# Altium schematic sheet LEDs.SchDoc
size A4
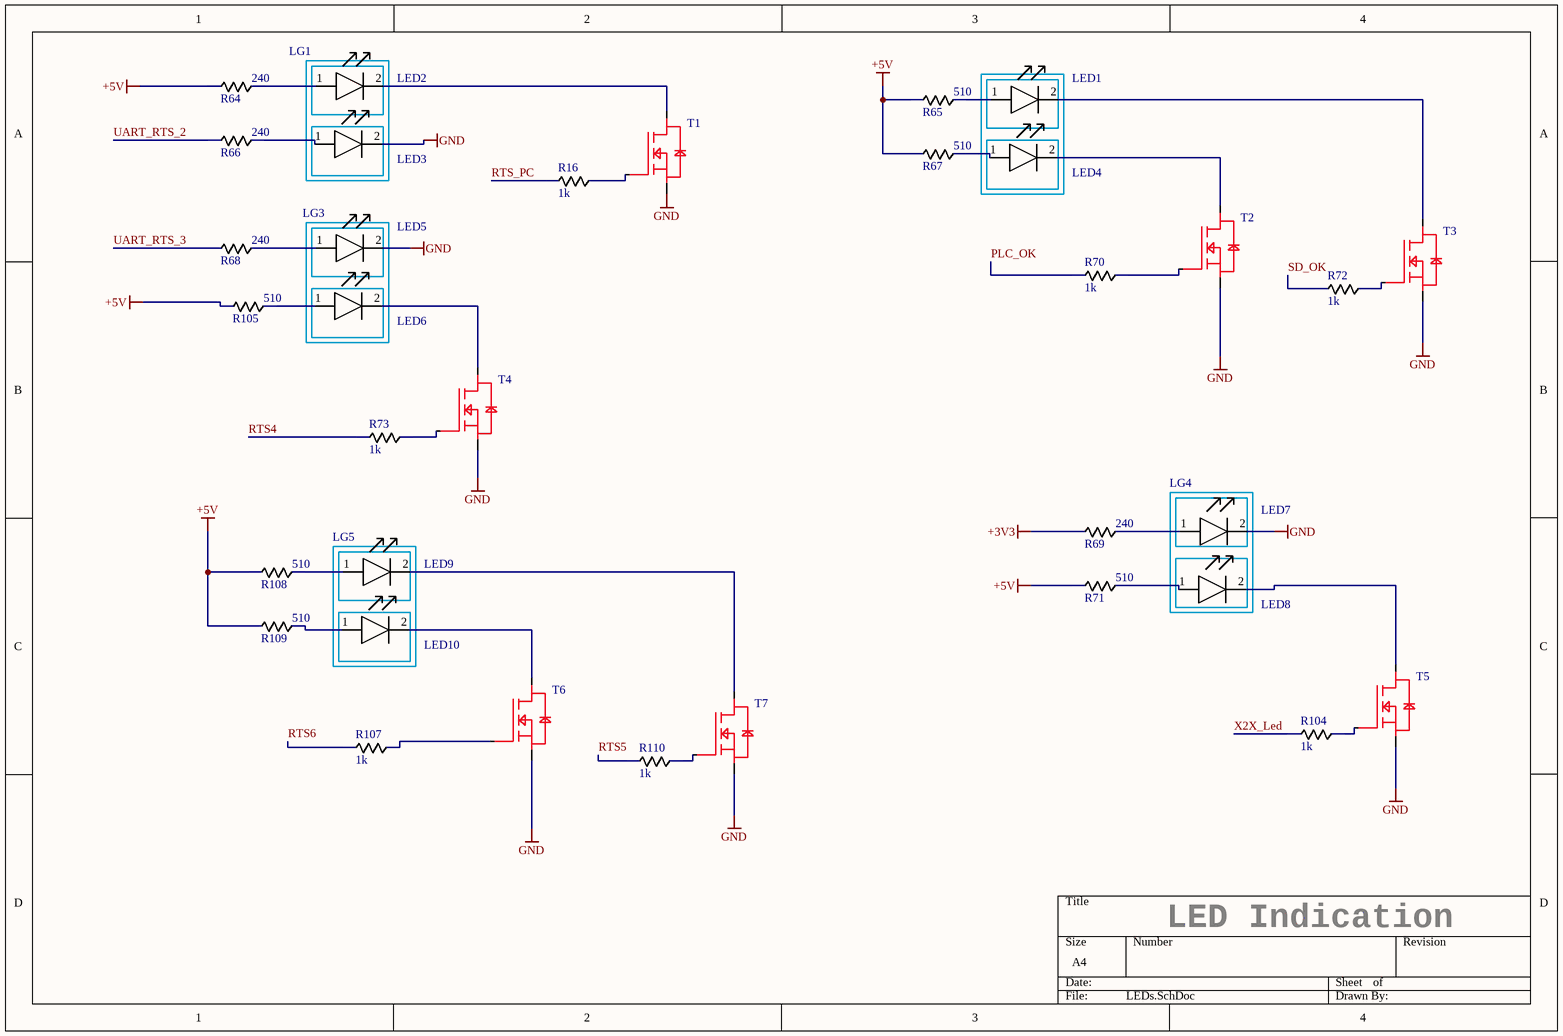
[diagram p0: LEDs.SchDoc]

## Parts
LED1  (no value)  [0603 - LED]
LED2  (no value)  [0603 - LED]
LED3  (no value)  [0603 - LED]
LED4  (no value)  [0603 - LED]
LED5  (no value)  [0603 - LED]
LED6  (no value)  [0603 - LED]
LED7  (no value)  [0603 - LED]
LED8  (no value)  [0603 - LED]
LED9  (no value)  [0603 - LED]
LED10  (no value)  [0603 - LED]
LG1  (no value)  [LED SMD DayLight]
LG2  (no value)  [LED SMD DayLight]
LG3  1k  [LED SMD DayLight]  (value not drawn)
LG4  (no value)  [LED SMD DayLight]
LG5  (no value)  [LED SMD DayLight]
R16  1k  [0603]
R64  240  [0603]
R65  510  [0603]
R66  240  [0603]
R67  510  [0603]
R68  240  [0603]
R69  240  [0603]
R70  1k  [0603]
R71  510  [0603]
R72  1k  [0603]
R73  1k  [0603]
R104  1k  [0603]
R105  510  [0603]
R107  1k  [0603]
R108  510  [0603]
R109  510  [0603]
R110  1k  [0603]
T1  (no value)  [SOT23]
T2  (no value)  [SOT23]
T3  (no value)  [SOT23]
T4  (no value)  [SOT23]
T5  (no value)  [SOT23]
T6  (no value)  [SOT23]
T7  (no value)  [SOT23]

## Nets
+3V3: R69.2
+5V: R64.2 R65.2 R67.2 R71.2 R105.2 R108.2 R109.2
GND: LED3.2 LED5.2 LED7.2 T1.2 T2.2 T3.2 T4.2 T5.2 T6.2 T7.2
PLC_OK: R70.2
RTS4: R73.2
RTS5: R110.2
RTS6: R107.2
RTS_PC: R16.2
SD_OK: R72.2
UART_RTS_2: R66.2
UART_RTS_3: R68.2
X2X_Led: R104.2
NetLED1_1: LED1.1 R65.1
NetLED1_2: LED1.2 T3.3
NetLED2_1: LED2.1 R64.1
NetLED2_2: LED2.2 T1.3
NetLED3_1: LED3.1 R66.1
NetLED4_1: LED4.1 R67.1
NetLED4_2: LED4.2 T2.3
NetLED5_1: LED5.1 R68.1
NetLED6_1: LED6.1 R105.1
NetLED6_2: LED6.2 T4.3
NetLED7_1: LED7.1 R69.1
NetLED8_1: LED8.1 R71.1
NetLED8_2: LED8.2 T5.3
NetLED9_1: LED9.1 R108.1
NetLED9_2: LED9.2 T7.3
NetLED10_1: LED10.1 R109.1
NetLED10_2: LED10.2 T6.3
NetR16_1: R16.1 T1.1
NetR70_1: R70.1 T2.1
NetR72_1: R72.1 T3.1
NetR73_1: R73.1 T4.1
NetR104_1: R104.1 T5.1
NetR107_1: R107.1 T6.1
NetR110_1: R110.1 T7.1

## Notes on the sheet
- LED Indication

## Library data of the parts
LED1 LED4 LED7 LED8 = LED 0603: Part Number: KP-1608SGC; Part Description: 0603 Single Colour LED Green
LED2 LED3 LED5 LED6 LED9 LED10 = LED 0603: Part Number: KP-1608SYC; Part Description: 0603 Single Colour LED Yellow
LG1 LG2 LG4 LG5 = Light Guide 2: Part Number: 5151094F; Part Description: Light Guide
LG3 = Light Guide 2: Part Number: RC0603FR-071KL; Part Description: Thick Film Resistor - 0603, 1kOhms, 1%, 1/10W
R16 R70 R72 R73 R104 R107 R110 = Resistor 0805: Part Description: Resistor 0603, 1kOhms, 5%, 1/10W; Part Number: RC0603JR-071KL
R64 R66 R68 R69 = Resistor 0805: Part Description: Resistor 0603, 240Ohms, 1%, 1/10W; Part Number: RC0603FR-07240RL
R65 R67 R71 R105 R108 R109 = Resistor 0805: Part Description: Resistor 0603, 510Ohms, 5%, 1/10W; Part Number: RC0603JR-07510RL
T1-T7 = IRLML2402: Part Description: MOSFETs SOT-23 N-CH LOGIC; Part Number: BSS138